# Altium schematic sheet BAT.SchDoc
size A; SheetNumber: 3; SheetTotal: 4
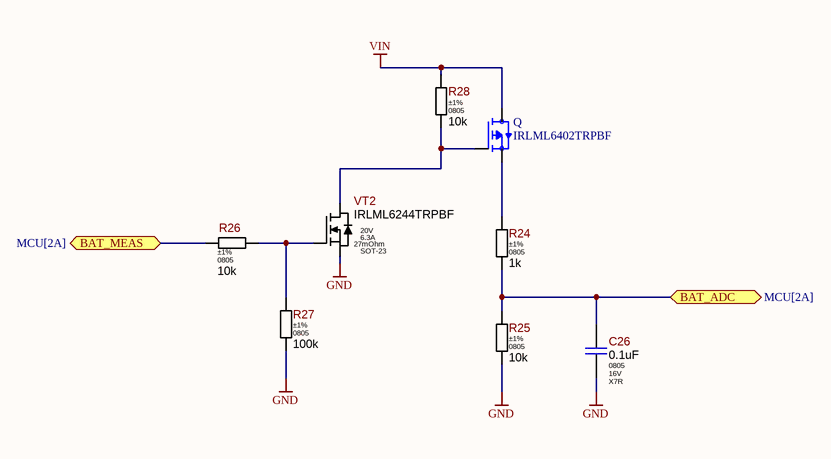
[diagram p0: BAT.SchDoc]

## Parts
C26  Package: 0805  Voltage: 16V  Dielectric Type: X7R  [C0805]  (hidden comment: 0.1uF)
Q  IRLML6402TRPBF  [SOT95P237X112-3N]
R24  Tolerance: ±1%  Package: 0805  [R0805]  (hidden comment: 1k)
R25  value 10k  Tolerance: ±1%  Package: 0805  [R0805]  (hidden comment: 1M)
R26  Tolerance: ±1%  Package: 0805  [R0805]  (hidden comment: 10k)
R27  value 100k  Tolerance: ±1%  Package: 0805  [R0805]  (hidden comment: 10k)
R28  Tolerance: ±1%  Package: 0805  [R0805]  (hidden comment: 10k)
VT2  Part Number: IRLML6244TRPBF  Vds: 20V  Id: 6.3A  Rds: 27mOhm  Package: SOT-23  [IRLMT]  (hidden comment: IRLML6244)

## Ports
BAT_ADC (bidir, see MCU[2A]), BAT_MEAS (bidir, see MCU[2A])

## Nets
GND: C26.2 R25.2 R27.2 VT2.2(S)
VIN: Q.3(D) R28.1
BAT_ADC: C26.1 R24.2 R25.1 ; port BAT_ADC
BAT_MEAS: R26.1 ; port BAT_MEAS
NetQ_1: Q.1(G) R28.2 VT2.3(D)
NetQ_2: Q.2(S) R24.1
NetR26_2: R26.2 R27.1 VT2.1(G)

## Library data of the parts
C26 = Capacitor-NonPolar: Part Number: GRM155R71C104JA88J; Manufacturer: Murata Electronics; Ajax_1C_ID: 25536; Ajax_1C_PN: 100nF 16V X7R 5% 0402 GRM155R71C104JA88J Ceramic Capacitor SMD RoHS; Standard Lead Time: 16 Weeks; Tolerance: ±5%; Replacement: NONE; Value: 0.1uF; Part Type: Ceramic / X7R / 0402; Component Type: SMD; Temperature Range: -55°C ~ 125°C; ComponentLink1URL: https://eu.mouser.com/datasheet/2/281/1/GRM155R71C104JA88_01A-1983984.pdf; Supplier 1: Mouser; Supplier Part Number 1: 81-GRM155R71C104JA8J; ComponentLink1Description: Datasheet
Q = IRLML6402TRPBF: RoHS Compliant | Industry-leading quality | Fast Switching | Low Profile _less than 1.1mm_ | P-Channel MOSFET | SOT-23 Footprint; MF: Infineon; Package: SOT-23 Infineon; Value: *; Price: None; MP: IRLML6402TRPBF; SnapEDA_Link: https://www.snapeda.com/parts/IRLML6402TRPBF/Infineon%20Technologies/view-part/523558/?ref=snap; Availability: Unavailable
R24-R28 = Resistor: 10 kOhms ±1% 1/16W 0402 Thick Film Resistor; Part Number: RC0402FR-0710KL; Manufacturer: Yageo; Ajax_1C_ID: 6717; Ajax_1C_PN: 10k 1% 0402 Resistors SMD RoHS; Power Rating: 0.062W; Voltage: 50V; Temperature Stability: ±100ppm/°C; Replacement: NONE; Component Type: SMD; Part Type: Thick Film; Temperature Range: -55°C ~ 155°C; ComponentLink1URL: https://eu.mouser.com/datasheet/2/447/PYu_RC_Group_51_RoHS_L_10-1664068.pdf; Supplier 1: Digi-Key; Supplier Part Number 1: 311-10.0KLRTR-ND; ComponentLink1Description: Datasheet
  R24: Value: 1k
  R26 R28: Value: 10k
VT2 = MOSFET-N-Channel: 20V, 6.3A max N-Channel HEXFET MOSFET, 21mOhm @ Vgs = 4.5V; Manufacturer: Infineon Technologies; Ajax_1C_ID: 5903; Ajax_1C_PN: IRLML6244TRPBF. полевой транзистор; Standard Lead Time: 15 Weeks; Replacement: NONE; Part Type: N-Channel; Component Type: SMD; Temperature Range: -55°C ~ 150°C; ComponentLink1URL: https://www.infineon.com/dgdl/irlml6244pbf.pdf?fileId=5546d462533600a4015356686fed261f; Supplier 1: Digi-Key; Supplier Part Number 1: IRLML6244TRPBFTR-ND; ComponentLink1Description: Datasheet